# Altium schematic sheet DecaWave.SchDoc
size A
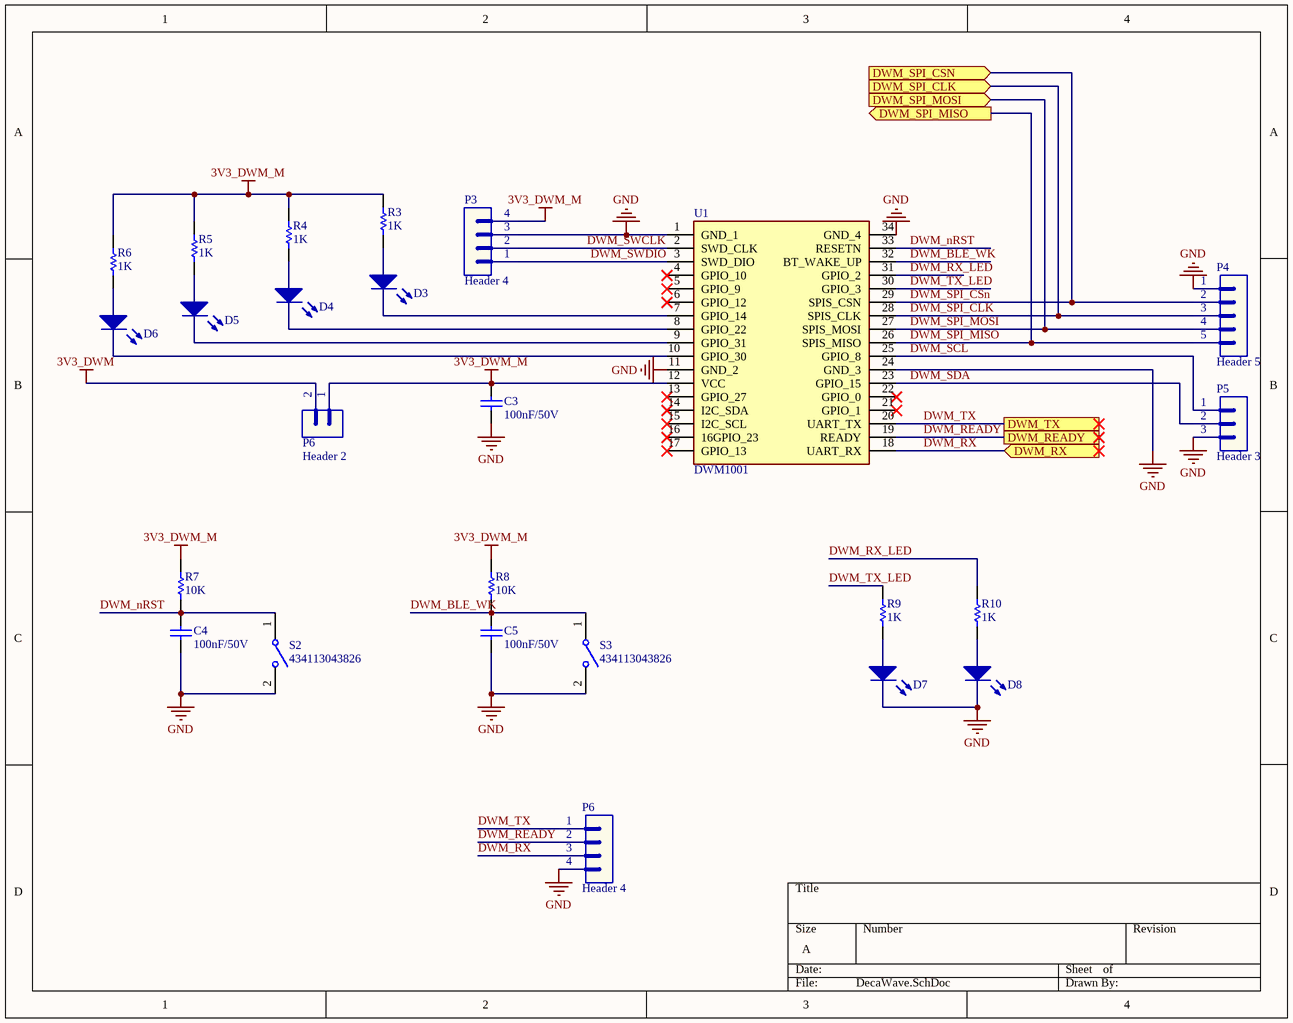
[diagram p0: DecaWave.SchDoc]

## Parts
(Parts that share a designator on the sheet are numbered #1, #2 ... from top to bottom, then left to right.)
C3  value 100nF/50V  [CAP-SM-0805]  (hidden comment: Cap-1nF-50V-0805)
C4  value 100nF/50V  [CAP-SM-0805]  (hidden comment: Cap-4.7uF-50V-0805)
C5  value 100nF/50V  [CAP-SM-0805]  (hidden comment: Cap-4.7uF-50V-0805)
D3  LED  [LED_0603_Blue]  (value not drawn)
D4  LED  [LED_0603_Blue]  (value not drawn)
D5  LED  [LED_0603_Blue]  (value not drawn)
D6  LED  [LED_0603_Blue]  (value not drawn)
D7  LED  [LED_0603_Blue]  (value not drawn)
D8  LED  [LED_0603_Blue]  (value not drawn)
P3  Header 4  [JP4]
P4  Header 5  [JP5]
P5  Header 3  [JP3]
P6#1  Header 2  [JP2]
P6#2  Header 4  [JP4]
R3  value 1K  [RES-SM-0805]  (hidden comment: Res-0-0805)
R4  value 1K  [RES-SM-0805]  (hidden comment: Res-0-0805)
R5  value 1K  [RES-SM-0805]  (hidden comment: Res-0-0805)
R6  value 1K  [RES-SM-0805]  (hidden comment: Res-0-0805)
R7  value 10K  [RES-SM-0805]  (hidden comment: Res-1K-0805)
R8  value 10K  [RES-SM-0805]  (hidden comment: Res-1K-0805)
R9  value 1K  [RES-SM-0805]  (hidden comment: Res-1K-0805)
R10  value 1K  [RES-SM-0805]  (hidden comment: Res-1K-0805)
S2  434113043826  [434113043826]
S3  434113043826  [434113043826]
U1  DWM1001  [DWM1001]

## Ports
DWM_READY, DWM_RX (in), DWM_SPI_CLK (in), DWM_SPI_CSN (in), DWM_SPI_MISO (out), DWM_SPI_MOSI (in), DWM_TX

## Nets
3V3_DWM: P6#1.2
3V3_DWM_M: C3.2 P3.4 P6#1.1 R3.2 R4.2 R5.2 R6.1 R7.2 R8.2 U1.12(VCC)
GND: C3.1 C4.1 C5.1 D7.2(K) D8.2(K) P3.3 P4.1 P5.3 P6#2.4 S2.2 S3.2 U1.1(GND_1) U1.11(GND_2) U1.24(GND_3) U1.34(GND_4)
DWM_BLE_WK: C5.2 R8.1 S3.1 U1.32(BT_WAKE_UP)
DWM_nRST: C4.2 R7.1 S2.1 U1.33(RESETN)
DWM_READY: P6#2.2 U1.19(READY) ; port DWM_READY
DWM_RX: P6#2.3 U1.18(UART_RX) ; port DWM_RX
DWM_RX_LED: R10.2 U1.31(GPIO_2)
DWM_SCL: P5.1 U1.25(GPIO_8)
DWM_SDA: P5.2 U1.23(GPIO_15)
DWM_SPI_CLK: P4.3 U1.28(SPIS_CLK) ; port DWM_SPI_CLK
DWM_SPI_CSn: P4.2 U1.29(SPIS_CSN) ; port DWM_SPI_CSN
DWM_SPI_MISO: P4.5 U1.26(SPIS_MISO) ; port DWM_SPI_MISO
DWM_SPI_MOSI: P4.4 U1.27(SPIS_MOSI) ; port DWM_SPI_MOSI
DWM_SWCLK: P3.2 U1.2(SWD_CLK)
DWM_SWDIO: P3.1 U1.3(SWD_DIO)
DWM_TX: P6#2.1 U1.20(UART_TX) ; port DWM_TX
DWM_TX_LED: R9.2 U1.30(GPIO_3)
NetD3_1: D3.1(A) R3.1
NetD3_2: D3.2(K) U1.7(GPIO_14)
NetD4_1: D4.1(A) R4.1
NetD4_2: D4.2(K) U1.8(GPIO_22)
NetD5_1: D5.1(A) R5.1
NetD5_2: D5.2(K) U1.9(GPIO_31)
NetD6_1: D6.1(A) R6.2
NetD6_2: D6.2(K) U1.10(GPIO_30)
NetD7_1: D7.1(A) R9.1
NetD8_1: D8.1(A) R10.1

Not connected (* = marked no-connect by the designer): U1 4(GPIO_10)* 5(GPIO_9)* 6(GPIO_12)* 13(GPIO_27)* 14(I2C_SDA)* 15(I2C_SCL)* 16(16GPIO_23)* 17(GPIO_13)* 21(GPIO_1)* 22(GPIO_0)*

## Library data of the parts
C3 = Cap-1nF-50V-0805: CAP CER 1000PF 100V X7R 0805; Manufacturer: Johanson Dielectrics Inc.; Manufacturer Part Number: 101X15W102MV4E; Local Supplier: thegioiic; Local Supplier Link: https://thegioiic.com/products/tu-1nf-50v-0805; Supplier 1: Digikey; Supplier 1 Link: https://www.digikey.com/product-detail/en/johanson-dielectrics-inc/101X15W102MV4E/709-1335-1-ND/2327235; Supplier 1 Part Number: 709-1335-1-ND
C4 C5 = Cap-4.7uF-50V-0805: CAP CER 4.7UF 50V X5R 0805; Manufacturer: Murata Electronics; Manufacturer Part Number: GRM21BR61H475KE51L; Local Supplier: thegioiic; Local Supplier Link: https://thegioiic.com/products/tu-4-7uf-50v-0805-cap; Supplier 1: Digikey; Supplier 1 Link: https://www.digikey.com/product-detail/en/murata-electronics/GRM21BR61H475KE51L/490-10751-1-ND/5251349; Supplier 1 Part Number: 490-10751-1-ND
P3 P6#2 = Header 4: Header, 4-Pin; LatestRevisionDate: 17-Jul-2002; LatestRevisionNote: Re-released for DXP Platform.; Publisher: Altium Limited
P4 = Header 5: Header, 5-Pin; LatestRevisionDate: 17-Jul-2002; LatestRevisionNote: Re-released for DXP Platform.; Publisher: Altium Limited
P5 = Header 3: Header, 3-Pin; LatestRevisionDate: 17-Jul-2002; LatestRevisionNote: Re-released for DXP Platform.; Publisher: Altium Limited
P6#1 = Header 2: Header, 2-Pin; LatestRevisionDate: 17-Jul-2002; LatestRevisionNote: Re-released for DXP Platform.; Publisher: Altium Limited
R3-R6 = Res-0-0805: RES 0 OHM JUMPER 0805; Manufacturer: Vishay Dale; Manufacturer Part Number: WSL080500000ZEA9; Local Supplier: thegioiic; Local Supplier Link: https://thegioiic.com/products/dien-tro-0-ohm-0805-5; Supplier 1: Digikey; Supplier 1 Link: https://www.digikey.com/product-detail/en/vishay-dale/WSL080500000ZEA9/541-3928-1-ND/7423223; Supplier 1 Part Number: 541-3928-1-ND
R7-R10 = Res-1K-0805: RES 1K OHM 1% 1/4W 0805; Manufacturer: Stackpole Electronics Inc; Manufacturer Part Number: RNCP0805FTD1K00; Local Supplier: thegioiic; Local Supplier Link: https://thegioiic.com/products/dien-tro-1k-ohm-0805-5; Supplier 1: Digikey; Supplier 1 Link: https://www.digikey.com/product-detail/en/stackpole-electronics-inc/RNCP0805FTD1K00/RNCP0805FTD1K00CT-ND/2240568; Supplier 1 Part Number: RNCP0805FTD1K00CT-ND
S2 S3 = 434113043826: WS-TASV J-Bend SMT Tact Switch 6x3.5mm, height 4.3mm, 260gf; Rated Voltage: 12VDC; Rated Current: 50mA; Washable: No; ComponentLink1Description: Manufacturer; ComponentLink1URL: http://www.we-online.de; ComponentLink2Description: Datasheet; ComponentLink2URL: https://katalog.we-online.com/em/datasheet/434113043826.pdf; Operating Temperature: -40 to +85degC; Part Number: 434113043826; Published Date: September 2019; Contact Material: Stainless Steel; Height: 4.3mm; Mounting Technology: SMT; Contact Plating: Silver; Operation Force: 260gf; Packaging: Tape and Reel; Terminal Material: Copper Alloy; Publisher: Wurth Elektronik; Terminal Plating: Silver
U1 = DWM1001: Manufacturer_Name: Decawave Limited; Datasheet Link: https://www.decawave.com/sites/default/files/dwm1001_datasheet.pdf; Height: 3mm; Manufacturer_Part_Number: DWM1001; Arrow Part Number: DWM1001